# EAGLE design BleSensorC (EAGLE 9.2.2)
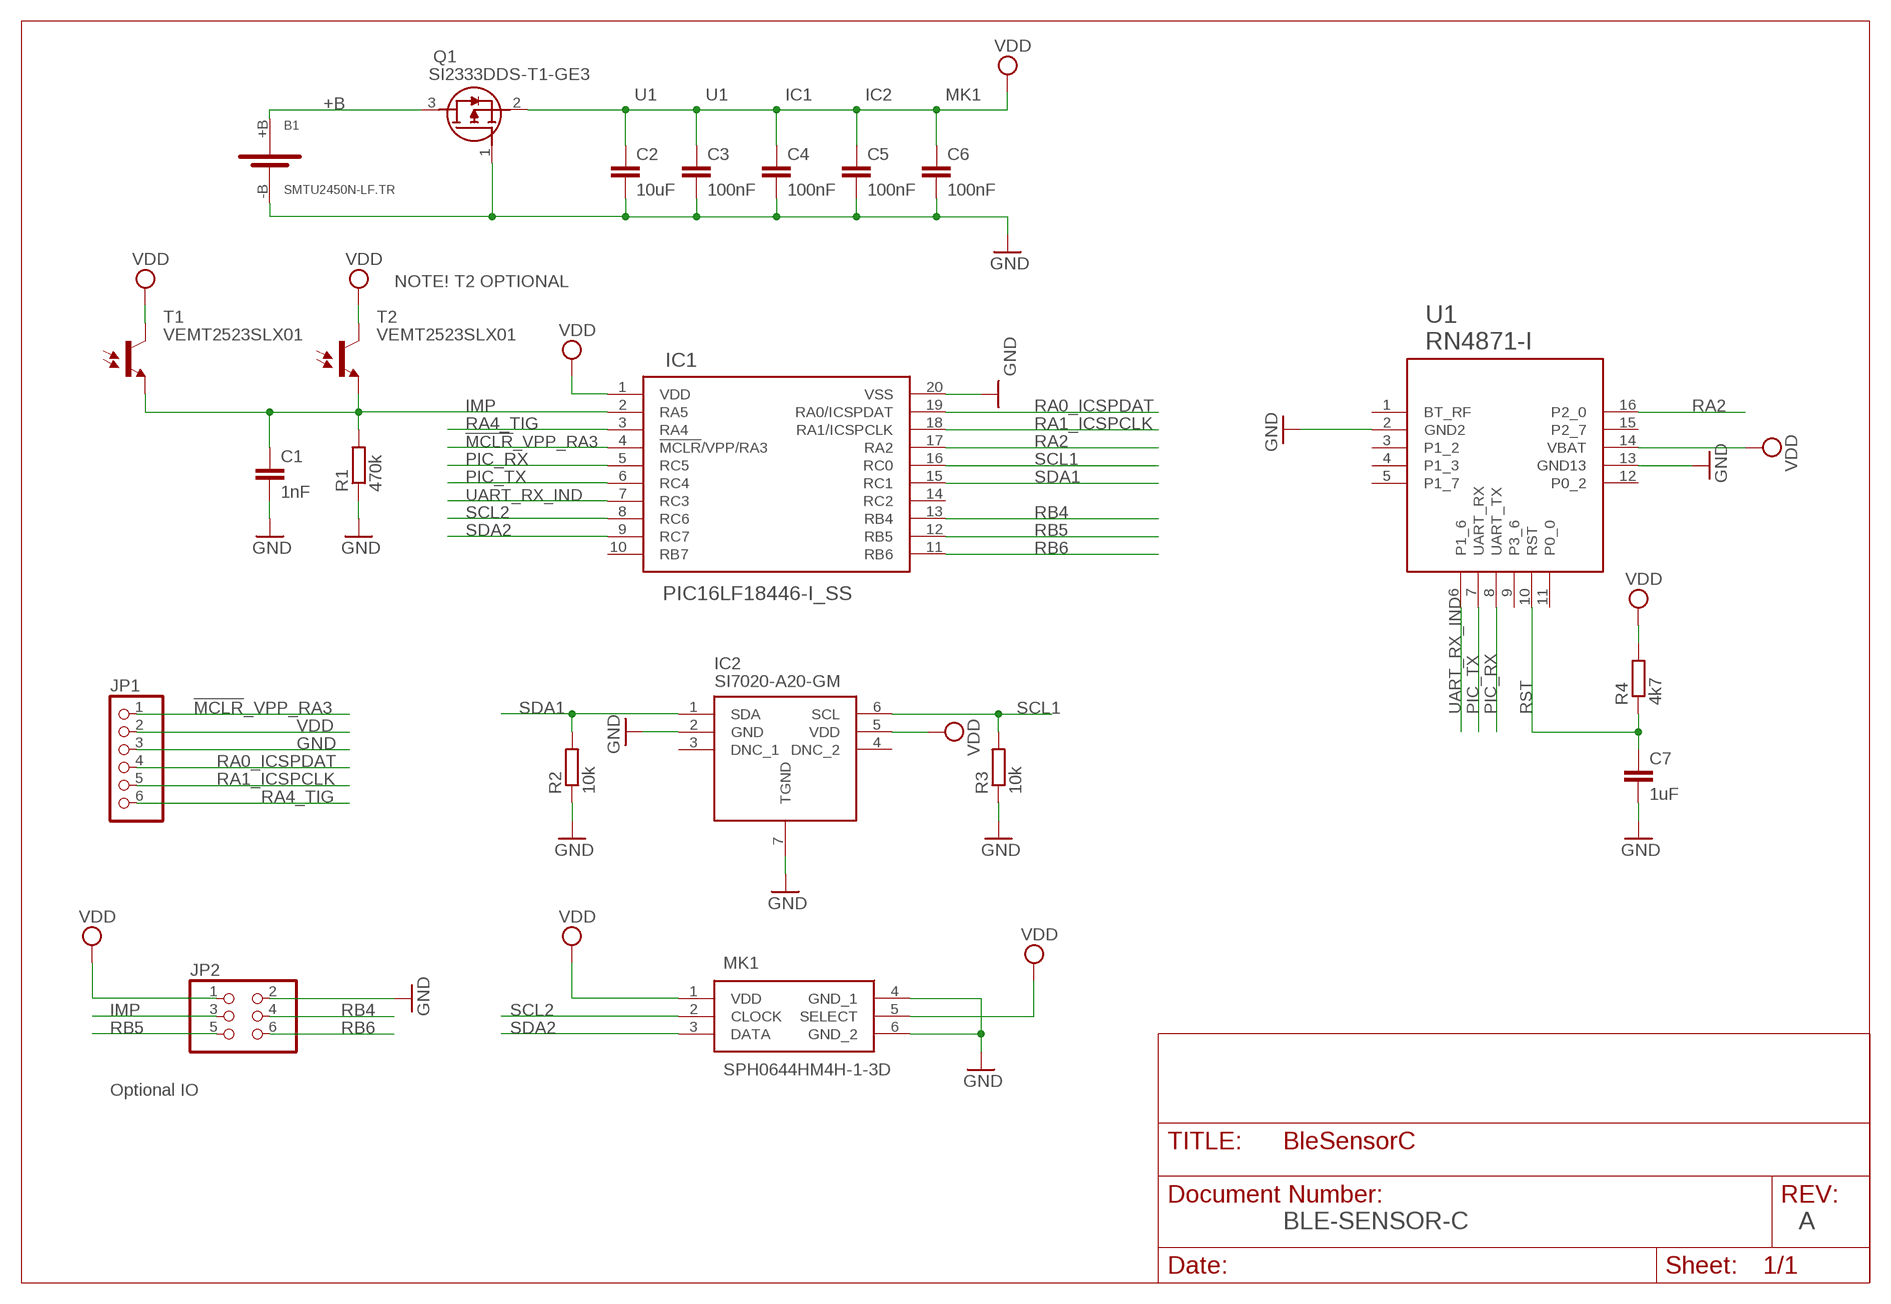
[diagram p0: schematic, sheet 1]
FRAME1 (DINA4_L): SPICEPREFIX: X

## Parts
B1  SMTU2450N-LF.TR  [SMTU2450N-LF]
C1  1nF  C-EUC0805  [C0805]
C2  10uF  C-EUC0805  [C0805]
C3  100nF  C-EUC0805  [C0805]
C4  100nF  C-EUC0805  [C0805]
C5  100nF  C-EUC0805  [C0805]
C6  100nF  C-EUC0805  [C0805]
C7  1uF  C-EUC0805  [C0805]
IC1  PIC16LF18446-I_SS  [SOP65P780X200-20]
IC2  SI7020-A20-GM  [DFN-6-3X3-SI7020]
JP1  PINHD-1X6-S  [1X06-S]
JP2  PINHD-2X3  [2X03]
MK1  SPH0644HM4H-1-3D  [SOJ88P324X95-6]
Q1  SI2333DDS-T1-GE3  [SOT95P237X112-3]
R1  470k  R-EU_R0805  [R0805]
R2  10k  R-EU_R0805  [R0805]
R3  10k  R-EU_R0805  [R0805]
R4  4k7  R-EU_R0805  [R0805]
T1  VEMT2523SLX01  [VEMT2523SL]
T2  VEMT2523SLX01  [VEMT2523SL]
U1  RN4871-I  [RN4871]

## Nets
!MCLR!_VPP_RA3: IC1.4(!MCLR!/VPP/RA3) JP1.1
+B: B1.+B Q1.3(D)
GND: B1.-B C1.2 C2.2 C3.2 C4.2 C5.2 C6.2 C7.2 IC1.20(VSS) IC2.2(GND) IC2.7(TGND) JP1.3 JP2.2 MK1.4(GND_1) MK1.6(GND_2) Q1.1(G) R1.1 R2.1 R3.1 U1.2(GND2) U1.13(GND13)
IMP: C1.1 IC1.2(RA5) JP2.3 R1.2 T1.E T2.E
PIC_RX: IC1.5(RC5) U1.8(UART_TX)
PIC_TX: IC1.6(RC4) U1.7(UART_RX)
RA0_ICSPDAT: IC1.19(RA0/ICSPDAT) JP1.4
RA1_ICSPCLK: IC1.18(RA1/ICSPCLK) JP1.5
RA2: IC1.17(RA2) U1.16(P2_0)
RA4_TIG: IC1.3(RA4) JP1.6
RB4: IC1.13(RB4) JP2.4
RB5: IC1.12(RB5) JP2.5
RB6: IC1.11(RB6) JP2.6
RST: C7.1 R4.1 U1.10(RST)
SCL1: IC1.16(RC0) IC2.6(SCL) R3.2
SCL2: IC1.8(RC6) MK1.2(CLOCK)
SDA1: IC1.15(RC1) IC2.1(SDA) R2.2
SDA2: IC1.9(RC7) MK1.3(DATA)
UART_RX_IND: IC1.7(RC3) U1.6(P1_6)
VDD: C2.1 C3.1 C4.1 C5.1 C6.1 IC1.1(VDD) IC2.5(VDD) JP1.2 JP2.1 MK1.1(VDD) MK1.5(SELECT) Q1.2(S) R4.2 T1.C T2.C U1.14(VBAT)
Unconnected: IC1.10(RB7) IC1.14(RC2) IC2.3(DNC_1) IC2.4(DNC_2) U1.1(BT_RF) U1.3(P1_2) U1.4(P1_3) U1.5(P1_7) U1.9(P3_6) U1.11(P0_0) U1.12(P0_2) U1.15(P2_7)

## Notes on the sheet
- U1 | U1 | IC1 | IC2 | MK1
- NOTE! T2 OPTIONAL
- Optional IO
- BLE-SENSOR-C | A

## Library data of the parts
B1 = esao:SMTU2450N-LF.TR: Coin Cell Battery Holders SFC MNT FOR CR2450N Source: Datasheet <https://componentsearchengine.com/Datasheets/1/SMTU2450N-LF BULK.pdf>; DESCRIPTION: Coin Cell Battery Holders SFC MNT FOR CR2450N; MOUSER_NO: 614-SMTU2450N-LF.TR; MPN: SMTU2450N-LF.TR; PACKAGE: SMD/SMT; SUPPLIER: Renata
C1-C7 = resistor:C-EU: CAPACITOR, European symbol
IC1 = SamacSys_Parts:PIC16LF18446-I_SS: 8-bit Microcontrollers - MCU 28KB, 2KB RAM, 2xPWMs, Comparator, DAC, 12-bit ADCC, CWG, EUSART, SPI/I2C Source: Datasheet <https://mouser.componentsearchengine.com/Datasheets/1/PIC16LF18446-I_SS.pdf>; DESCRIPTION: 8-bit Microcontrollers - MCU 28KB, 2KB RAM, 2xPWMs, Comparator, DAC, 12-bit ADCC, CWG, EUSART, SPI/I2C; HEIGHT: 2mm; MANUFACTURER_NAME: Microchip; MANUFACTURER_PART_NUMBER: PIC16LF18446-I/SS
IC2 = esao:SI7020-A20-GM: Si7020G Dig RH Temp Sensor Silicon Labs Si7020-A20-GM Temperature & Humidity Sensor, -40 +85 C, 6-Pin DFN Source: Datasheet <https://componentsearchengine.com/Datasheets/1/SI7020-A20-GM.pdf>; DESCRIPTION: Si7020G Dig RH Temp Sensor Silicon Labs Si7020-A20-GM Temperature & Humidity Sensor, -40 +85 C, 6-Pin DFN; HEIGHT: 0.8mm; MANUFACTURER_NAME: Silicon Labs; MANUFACTURER_PART_NUMBER: Si7020-A20-GM; MOUSER_PART_NUMBER: 634-SI7020-A20-GM
JP1 = esao:PINHD-1X6: PIN HEADER
JP2 = pinhead:PINHD-2X3: PIN HEADER
MK1 = esao:SPH0644HM4H-1: MEMS Microphones Source: Datasheet <http://www.knowles.com/eng/content/download/6318/115469/version/1/file/SPH0644HM4H-1 RevB.PDF>
Q1 = esao:SI2333DDS-T1-GE3: MOSFET P-Ch 12V 5A TrenchFET SOT23 Vishay SI2333DDS-T1-GE3 P-channel MOSFET Transistor, 6 A, 12 V, 3-Pin SOT-23 Source: Datasheet <https://componentsearchengine.com/Datasheets/1/SI2333DDS-T1-GE3.pdf>; DESCRIPTION: MOSFET P-Ch 12V 5A TrenchFET SOT23 Vishay SI2333DDS-T1-GE3 P-channel MOSFET Transistor, 6 A, 12 V, 3-Pin SOT-23; HEIGHT: 1.12mm; MANUFACTURER_NAME: Vishay; MANUFACTURER_PART_NUMBER: SI2333DDS-T1-GE3; MOUSER_PART_NUMBER: 78-SI2333DDS-T1-GE3
R1-R4 = resistor:R-EU_: RESISTOR, European symbol
T1 T2 = esao:VEMT2523SLX01: Silicon NPN Phototransistor, SMD package. The device is sensitive to visible and near infrared radiation. Source: Datasheet <https://www.mouser.fi/ProductDetail/Vishay-Semiconductors/VEMT2523SLX01?qs=sGAEpiMZZMvMXeU%252bpcMAVP7WYja9XbLe>
U1 = esao:RN4871-I: Microchip RN4871 Bluetooth® 4.2 Low Energy Module source: Datasheet <https://www.mouser.fi/ProductDetail/Microchip-Technology/RN4871-I-RM130?qs=%2fha2pyFadugbWRblycIFPfAkyk%252bNoj4GzzqLRYkscLWoLLYIFodr6Q%3d%3d>; DESCRIPTION: Microchip RN4871 Bluetooth® 4.2 Low Energy Module; MOUSER_NO: 579-RN4871IRM130; MPN: RN4871-I/RM130; PACAKAGE: RN4871-I SMD; SUPPLIER: Microchip Technology

## Board
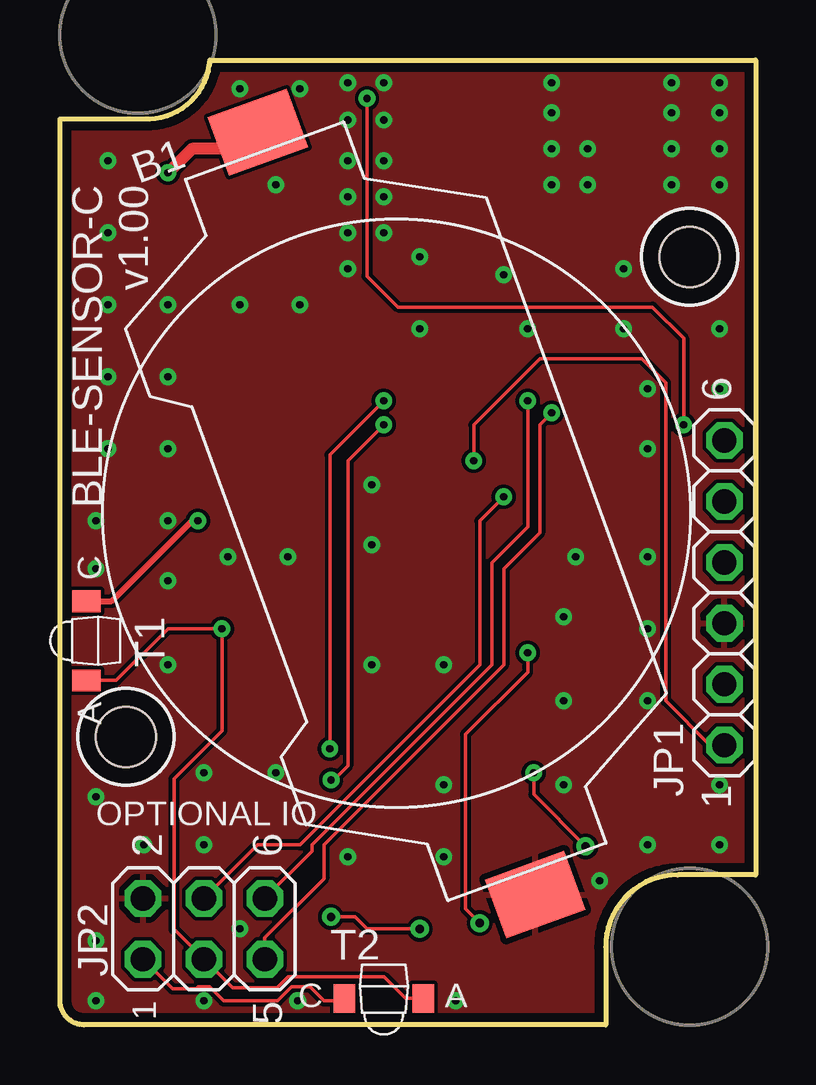
[diagram p1: board, top side]
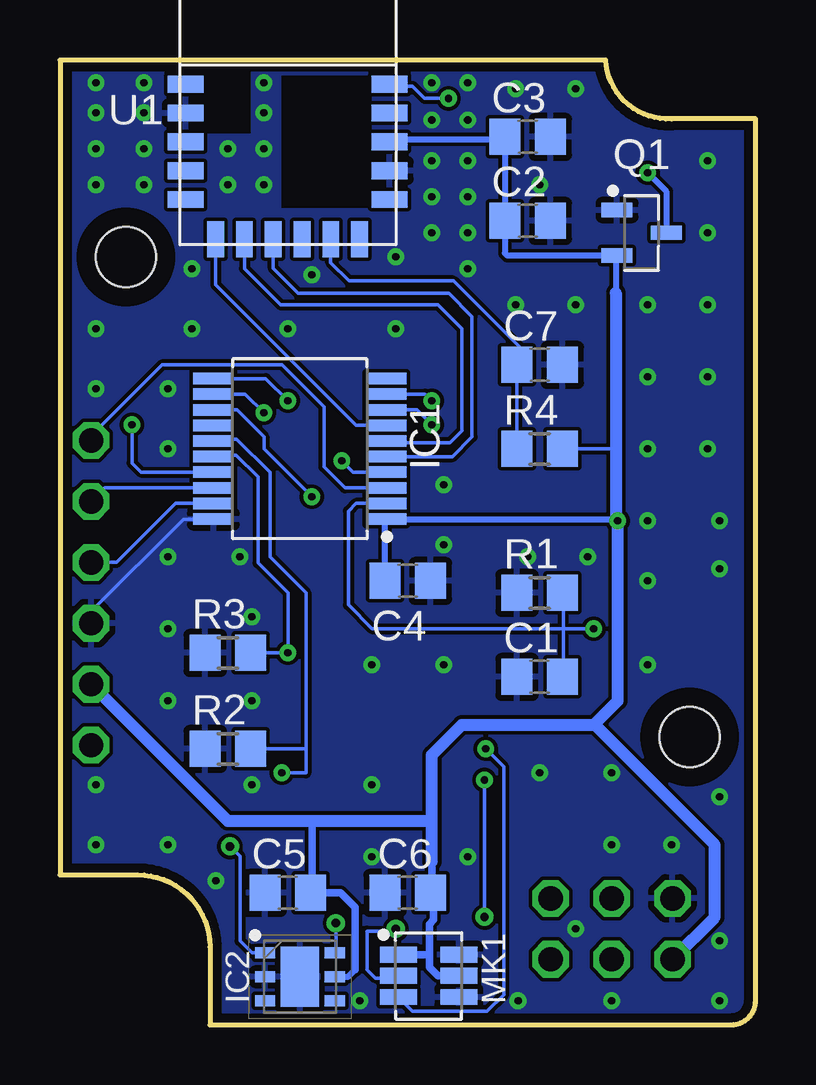
[diagram p2: board, bottom side, seen from below]

Size 29 x 40.2 mm. Coordinates in mm from the lower left corner, seen from the top.
Outline: 1,0 arc-90 0,1 0,37.75 3.5,37.75 arc90 6.25,40.2 29,40.2 29,6.25 25.75,6.25 arc90 22.75,3.25 22.75,0 1,0
Copper layers (1*16): Top 0.035mm / dielectric 1.5mm / Bottom 0.035mm
Design rules "default *": minimum track width 6mil, minimum drill 0.3mm, track to track 6mil, track to pad 6mil, pad to pad 6mil, via to via 6mil, smd to smd 6mil, copper to edge 15mil, drill to drill 6mil, minimum pad ring 10mil, minimum via ring 8mil, stop-mask expansion 4mil, vias tented up to drill 14mil, thermal gap 10mil
Holes 2.5 mm at 26.25,32 2.75,12
tRestrict: area 1.1,10.3 to 4.4,13.7; area 24.6,30.4 to 27.9,33.6
bRestrict: area 24.6,30.4 to 27.9,33.6; area 1.1,10.3 to 4.4,13.7

### Footprints (pad centres in the part's own frame; a part is rotated, then mirrored left to right if it is on the bottom)
SMTU2450N-LF = smd 3.5 x 2.6: +B 0,16.8; -B 0,-17
C0805 = smd 1.3 x 1.5: 1 -0.95,0; 2 0.95,0
SOP65P780X200-20 = smd 1.702 x 0.475: 1 -3.603,2.925; 2 -3.603,2.275; 3 -3.603,1.625; 4 -3.603,0.975; 5 -3.603,0.325; 6 -3.603,-0.325; 7 -3.603,-0.975; 8 -3.603,-1.625; 9 -3.603,-2.275; 10 -3.603,-2.925; 11 3.603,-2.925; 12 3.603,-2.275; 13 3.603,-1.625; 14 3.603,-0.975; 15 3.603,-0.325; 16 3.603,0.325; 17 3.603,0.975; 18 3.603,1.625; 19 3.603,2.275; 20 3.603,2.925
DFN-6-3X3-SI7020 = smd 0.85 x 0.45: 1 -1.45,1; 2 -1.45,0; 3 -1.45,-1; 4 1.45,-1; 5 1.45,0; 6 1.45,1 | smd 1.6 x 2.5: 7 0,0
1X06-S = drill 1.016 octagon: 1 -6.35,0; 2 -3.81,0; 3 -1.27,0; 4 1.27,0; 5 3.81,0; 6 6.35,0
2X03 = drill 1.016 octagon: 1 -2.54,-1.27; 2 -2.54,1.27; 3 0,-1.27; 4 0,1.27; 5 2.54,-1.27; 6 2.54,1.27
SOJ88P324X95-6 = smd 1.542 x 0.659: 1 -1.264,0.884; 2 -1.264,0; 3 -1.264,-0.884; 4 1.264,-0.884; 5 1.264,0; 6 1.264,0.884
SOT95P237X112-3 = smd 1.298 x 0.597: 1 -1.027,0.95; 2 -1.027,-0.95; 3 1.027,0
R0805 = smd 1.3 x 1.5: 1 -0.95,0; 2 0.95,0
VEMT2523SL = smd 0.9 x 1.2: C -1.65,0; E 1.65,0
RN4871 = smd 1.5 x 0.7: 1 -3.76,2.19; 2 -3.76,0.99; 3 -3.76,-0.21; 4 -3.76,-1.41; 5 -3.76,-2.61; 12 4.74,-2.61; 13 4.74,-1.41; 14 4.74,-0.21; 15 4.74,0.99; 16 4.74,2.19 | smd 0.7 x 1.5: 6 -2.51,-4.26; 7 -1.31,-4.26; 8 -0.11,-4.26; 9 1.09,-4.26; 10 2.29,-4.26; 11 3.49,-4.26

### Placement (x,y rotation side)
B1  14,21.4 20 top
C1  9,14.5 180 bottom
C2  9.5,33.5 0 bottom
C3  9.5,37 0 bottom
C4  14.5,18.5 0 bottom
C5  19.5,5.5 180 bottom
C6  14.5,5.5 180 bottom
C7  9,27.5 0 bottom
IC1  19,24 180 bottom
IC2  19,2 0 bottom
JP1  27.7,18 90 top
JP2  6,4 0 top
MK1  13.63,2.04 0 bottom
Q1  4.75,33 0 bottom
R1  9,18 0 bottom
R2  22,11.5 0 bottom
R3  22,15.5 0 bottom
R4  9,24 0 bottom
T1  1.1,16 270 top
T2  13.5,1.1 0 top
U1  20,37 0 bottom

### Tracks (layer width: path | path; a pad name or v marks a point on that pad's centre or on a via)
!MCLR!_VPP_RA3  (via drill 0.3)
  Top 0.152: JP1.1 27.1,11.65 25.25,13.5 25.25,26.75 24.25,27.75 20,27.75 17.25,25 v17.25,23.5
  Bottom 0.152: IC1.4 16.77,23.02 v17.25,23.5
+B  (via drill 0.3)
  Top 0.254: B1.+B 7.57,36.5
  Top 0.508: 7.57,36.5 5.5,36.5 v4.5,35.5
  Bottom 0.254: v4.5,35.5 3.72,34.72 Q1.3
GND  (via drill 0.3)
  Bottom 0.152: JP1.3 27.7,17.23 23.85,21.07 IC1.20
  other vias: 13.5,39.25 12,39.25 12,37.7 13.5,37.7 13.5,36 12,36 12,34.5 13.5,34.5 13.5,33 12,33 12,31.5 15,32 18.5,31.25 23.5,31.5 25.5,35 27.5,35 27.5,36.5 25.5,36.5 25.5,38 25.5,39.25 27.5,39.25 27.5,38 10,39 7.5,39 23.5,29 19.5,29 15,29 10,30 7.5,30 9,35 2,36 2,33 2,30 2,27 2,24 4.5,30 4.5,27 4.5,24 4.5,21 27.5,29 27.5,26.5 24.5,26.5 24.5,24 24.5,19.5 24.5,16.5 24.5,13.5 27.5,10 21,10 16,15 13,15 4.5,18.5 4.5,15 22,36.5 22,35 20.5,35 20.5,36.5 20.5,38 20.5,39.25 9,10.5 6,10.5 1.5,9.5 3.5,7.5 1.5,3.5 1.5,1 13,22.5 9.5,19.5 13,20 21.5,19.5 21,17 21,13.5 24.5,7.5 27.5,7.5 7.5,4 6,7.5 1.5,19 1.5,21 7,19.5 6,1 9.9,1 16.5,1 16,7 12,7 16,10 22.5,6
  pour Bottom: 22.7,0 1,0 arc-90 0,1 0,37.75 3.5,37.75 arc90 6.25,40.2 29,40.2 29,6.3 25.7,6.3 arc90 22.7,3.3
  pour Top: 22.7,0 1,0 arc-90 0,1 0,37.75 3.5,37.75 arc90 6.2,40.2 29,40 29,6.2 25.7,6.2 arc90 22.7,3.2
IMP  (via drill 0.3)
  Top 0.152: T1.E 2.35,14.35 4.5,16.5 v6.75,16.5 6.75,12.25 4.75,10.25 4.75,3.98 JP2.3 7.19,1.54 9.05,1.54 9.51,2 13.5,2 14.4,1.1 T2.E
  Bottom 0.152: IC1.2 16.66,21.73 16.98,21.41 16.98,17.49 15.99,16.51 v6.76,16.51 v6.75,16.5 | 8.01,14.85 8.01,17.85
PIC_RX
  Bottom 0.152: IC1.5 12.63,23.68 11.82,24.49 11.82,29.51 12.79,30.48 19.07,30.48 20.11,31.52 U1.8
PIC_TX
  Bottom 0.152: U1.7 21.31,31.51 19.8,30 13.25,30 12.25,29 12.25,24.75 12.75,24.25 15.32,24.25 IC1.6
RA0_ICSPDAT
  Bottom 0.152: IC1.19 24.18,21.73 26.64,19.27 JP1.4
RA1_ICSPCLK
  Bottom 0.152: JP1.5 27.14,22.38 IC1.18
RA2  (via drill 0.3)
  Top 0.152: v12.8,38.6 12.8,31.2 14.1,29.9 24.7,29.9 26,28.6 v26,25
  Bottom 0.152: U1.16 15.17,39.1 14.3,39.1 13.8,38.6 v12.8,38.6 | v26,25 26,23.4 25.62,23.02 IC1.17
RA4_TIG
  Bottom 0.152: IC1.3 17.12,22.38 18,23.25 18,25.75 19.75,27.5 24.75,27.5 27.7,24.55 JP1.6
RB4  (via drill 0.3)
  Top 0.152: v18.5,22 17.5,21 17.5,15 10,7.5 8.23,7.5 JP2.4
  Bottom 0.152: IC1.13 21.62,25.62 20.5,24.5 20.5,24 v18.5,22
RB5  (via drill 0.3)
  Top 0.152: v20.5,25.5 20,25 20,20.5 18.5,19 18.5,15 11,7.5 11,6.09 8.54,3.63 JP2.5
  Bottom 0.152: IC1.12 21.27,26.27 v20.5,25.5
RB6  (via drill 0.3)
  Top 0.152: v19.5,26 19.5,20.75 18,19.25 18,15 10.5,7.5 10.5,7.23 JP2.6
  Bottom 0.152: IC1.11 20.43,26.93 v19.5,26
RST
  Bottom 0.152: 9.95,23.87 C7.1 9.85,28.25 12.6,31 16.95,31 17.71,31.76 U1.10
SCL1  (via drill 0.3, 0.35)
  Top 0.152: v17.5,4.24 16.9,4.84 16.9,12.1 19.5,14.7 v19.5,15.5
  Bottom 0.152: R3.2 v19.5,15.5 19.5,18 20.75,19.25 20.75,22.83 21.66,23.74 22.54,23.74 IC1.16 | IC2.6 17.5,3.05 v17.5,4.24
SCL2  (via drill 0.3, 0.35)
  Top 0.152: v13.5,25 12,23.5 12,10.8 11.4,10.2 v11.3,10.2 | v11.3,4.5 12.3,4.5 12.8,4 v15,4
  Bottom 0.152: IC1.8 14.12,25.62 v13.5,25 | v11.3,10.2 v11.3,4.5 | MK1.2 14.99,1.94 15.84,1.94 16.2,2.3 16.2,3.9 15.1,3.9 v15,4
SDA1  (via drill 0.3, 0.35)
  Top 0.152: v21.91,7.44 19.75,9.6 v19.75,10.5
  Bottom 0.152: R2.2 18.75,11.5 | v19.75,10.5 18.75,10.5 18.75,11.5 | IC1.15 22.54,24.39 21.63,24.39 20.25,23.02 20.25,19.5 18.75,18 18.75,11.5 | v21.91,7.44 21.5,7.03 21.5,3.5 21,3 IC2.1
SDA2  (via drill 0.3)
  Top 0.152: v13.5,26 11.25,23.75 v11.25,11.5
  Bottom 0.152: IC1.9 13.78,26.27 v13.5,26 | MK1.3 14.29,0.56 11.2,0.56 10.5,1.26 10.5,10.75 v11.25,11.5
UART_RX_IND
  Bottom 0.152: IC1.7 16.66,24.98 22.51,30.83 U1.6
VDD  (via drill 0.3)
  Top 0.152: JP2.1 4.69,1.5 5.68,1.5 5.76,1.58 6.24,1.58 6.82,1 9.08,1 9.66,1.58 10.42,1.58 11,1 11.75,1 T2.C
  Top 0.254: T1.C 2.15,17.65 5.5,21 v5.75,21
  Bottom 0.152: R4.2 5.83,24 | 15.45,20.88 15.25,21.07 | 15.24,36.9 U1.14
  Bottom 0.254: 5.83,24 5.83,30.5 5.83,32 Q1.2 10.35,32.05 10.45,32.15 C3.1 | 5.83,21.08 v5.75,21 5.83,21.07 15.25,21.07 IC1.1 | 15.45,18.52 15.45,20.88 | 13.56,5.5 13.56,5.42 | 13.43,5.49 13.55,5.49 | 18.65,6.1 C5.1 18.5,5.2 | IC2.5 17,2 16.7,2.3 | 15.24,36.9 10.45,36.9 | 13.6,3 13.68,2.92
  Bottom 0.305: 18.5,5.2 18.5,8.5 | 13.5,5.45 13.5,6.8 | 16.7,2.3 16.7,4.9 17.3,5.5 C5.1 | 13.43,5.49 13.43,4.38 13.6,4.2 13.6,3 13.6,2.4 13.24,2.04 MK1.5 | 13.68,2.92 MK1.1
  Bottom 0.508: 5.83,30.5 5.83,21.08 | 13.5,8.5 13.5,11.25 12.25,12.5 6.75,12.5 | 6.75,12.5 5.75,13.5 v5.75,21 | JP1.2 22.01,8.5 18.5,8.5 13.5,8.5 | JP2.1 1.7,4.49 1.7,7.5 6.7,12.5 6.75,12.5 | 13.5,6.8 13.5,8.5

### Text on the board
tNames: BLE-SENSOR-C / v1.00 | 6 | 1 | OPTIONAL IO | 2 | 6 | 1 | 5